# Altium schematic sheet УШЯИ.411522.033Э3_5.SchDoc
size 420 x 297 mm; SheetNumber: 5; SheetTotal: 5
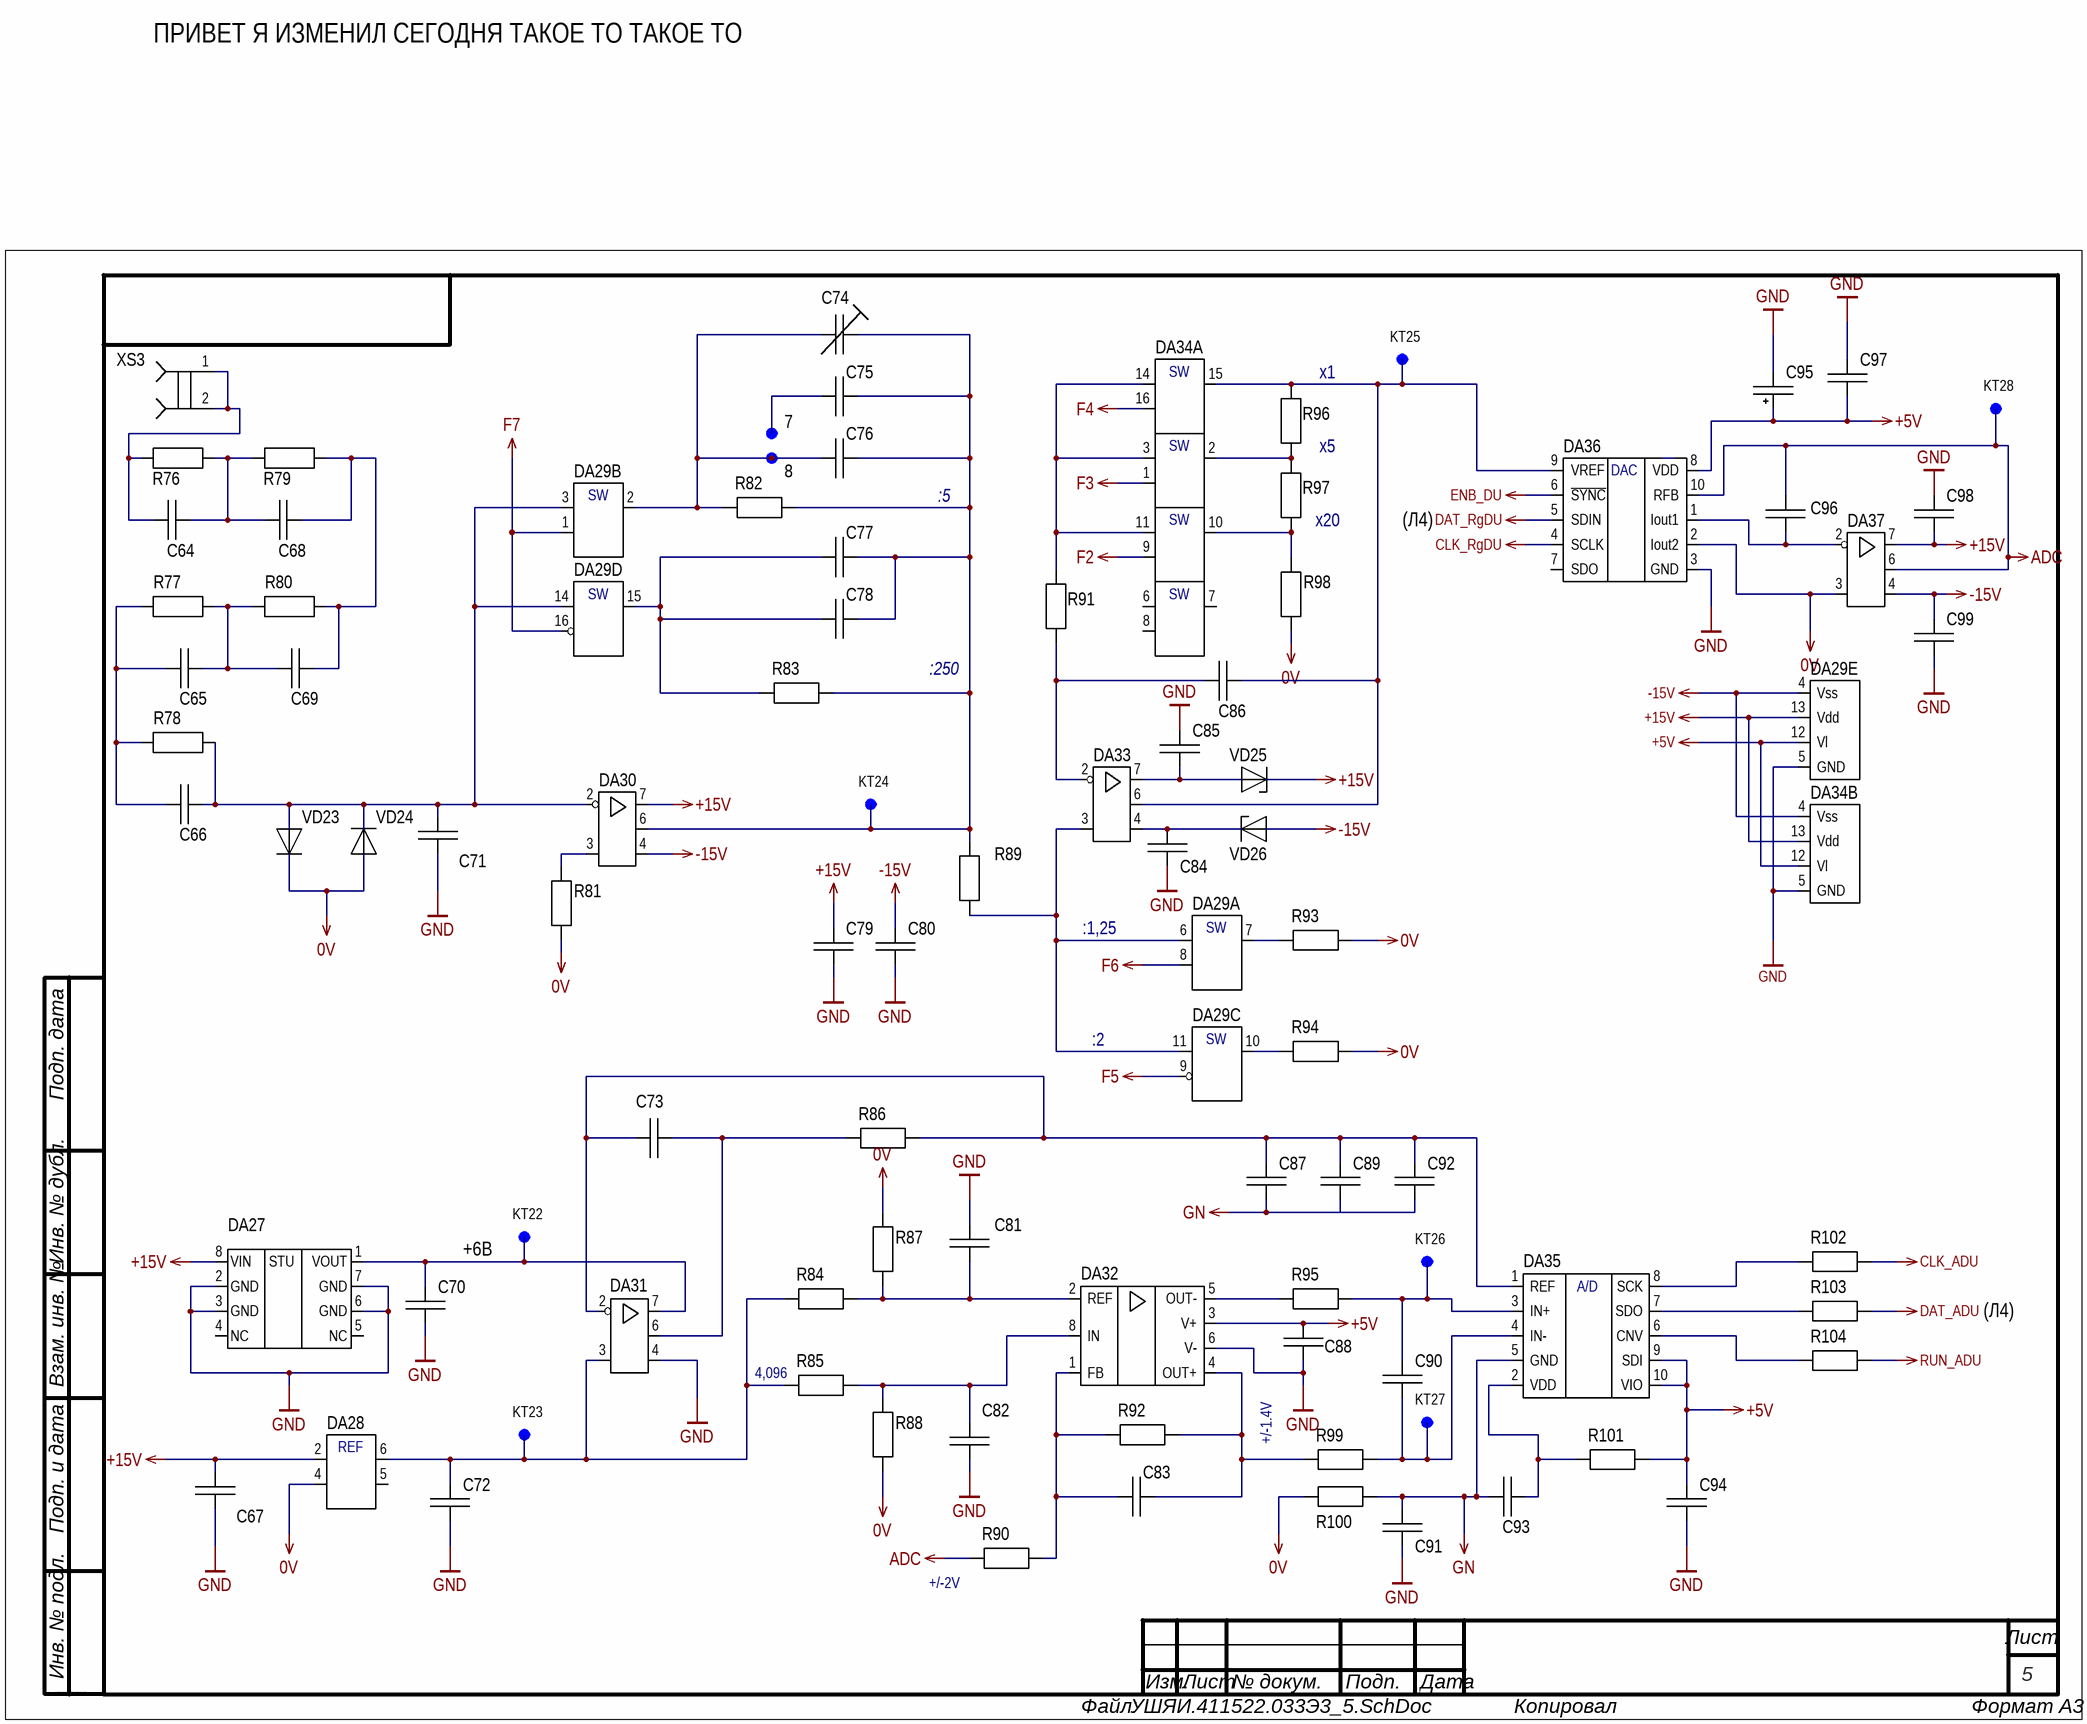
[diagram p0: УШЯИ.411522.033Э3_5.SchDoc]

## Parts
7  OTV10  [OTV10]  (value not drawn)  (no BOM)
8  OTV10  [OTV10]  (value not drawn)  (no BOM)
C64  CC45SL3JD470JYGNA  [CC45S]  (value not drawn)
C65  CC45SL3JD470JYGNA  [CC45S]  (value not drawn)
C66  CC45SL3JD470JYGNA  [CC45S]  (value not drawn)
C67  1206-X7R-50 B-0,33 мкФ+-10%  [CAP: 1206]  (value not drawn)
C68  CC45SL3JD470JYGNA  [CC45S]  (value not drawn)
C69  CC45SL3JD470JYGNA  [CC45S]  (value not drawn)
C70  1206-X7R-50 B-0,1 мкФ+-10%  [CAP: 1206]  (value not drawn)
C71  1206-X7R-50 B-120 пФ+-10%  [CAP: 1206]  (value not drawn)
C72  1206-X7R-50 B-0,1 мкФ+-10%  [CAP: 1206]  (value not drawn)
C73  1206-X7R-50 B-1 нФ+-10%  [CAP: 1206]  (value not drawn)
C74  TZC3P200A110  [TZC3]  (value not drawn)
C75  1206-NP0-50 B-10 пФ+-5%  [CAP: 1206]  (value not drawn)
C76  1206-X7R-50 B-22 пФ+-10%  [CAP: 1206]  (value not drawn)
C77  0805-NP0-50 В-2200 пФ +-1%  [CAP: 0805]  (value not drawn)
C78  0805-NP0-50 В-150 пФ +-1%  [CAP: 0805]  (value not drawn)
C79  1206-X7R-50 B-0,33 мкФ+-10%  [CAP: 1206]  (value not drawn)
C80  1206-X7R-50 B-0,33 мкФ+-10%  [CAP: 1206]  (value not drawn)
C81  1206-X7R-50 B-0,1 мкФ+-10%  [CAP: 1206]  (value not drawn)
C82  1206-X7R-50 B-0,1 мкФ+-10%  [CAP: 1206]  (value not drawn)
C83  0805-C0G-50 В-240 пФ +-5%  [CAP: 0805]  (value not drawn)
C84  1206-X7R-50 B-0,33 мкФ+-10%  [CAP: 1206]  (value not drawn)
C85  1206-X7R-50 B-0,33 мкФ+-10%  [CAP: 1206]  (value not drawn)
C86  1206-X7R-50 B-33 пФ+-10%  [CAP: 1206]  (value not drawn)
C87  0805-X5R-25 В-10 мкФ +-10%  [CAP: 0805]  (value not drawn)
C88  1206-X7R-50 B-0,1 мкФ+-10%  [CAP: 1206]  (value not drawn)
C89  1206-X7R-50 B-2,2 мкФ+-10%  [CAP: 1206]  (value not drawn)
C90  1206-X7R-50 B-0,01 мкФ+-10%  [CAP: 1206]  (value not drawn)
C91  1206-X7R-50 B-1 нФ+-10%  [CAP: 1206]  (value not drawn)
C92  1206-X7R-50 B-2,2 мкФ+-10%  [CAP: 1206]  (value not drawn)
C93  1206-X7R-50 B-2,2 мкФ+-10%  [CAP: 1206]  (value not drawn)
C94  1206-X7R-50 B-0,33 мкФ+-10%  [CAP: 1206]  (value not drawn)
C95  TAJA106K010RNJ  [Tantal A]  (value not drawn)
C96  1206-X7R-50 B-33 пФ+-10%  [CAP: 1206]  (value not drawn)
C97  1206-X7R-50 B-0,1 мкФ+-10%  [CAP: 1206]  (value not drawn)
C98  1206-X7R-50 B-0,33 мкФ+-10%  [CAP: 1206]  (value not drawn)
C99  1206-X7R-50 B-0,33 мкФ+-10%  [CAP: 1206]  (value not drawn)
DA27  L78L06ACD13TR  [8-SOIC]  (value not drawn)
DA28  ADR434BR  [8-SOIC]  (value not drawn)
DA29  ADG433BR  [16-SOIC]  (value not drawn)  (parts A,B,C,D,E of 5)
DA30  ADA4627-1ARZ  [8-SOIC]  (value not drawn)
DA31  AD8031ARZ  [8-SOIC]  (value not drawn)
DA32  ADA4941-1YRZ  [8-SOIC]  (value not drawn)
DA33  ADA4627-1ARZ  [8-SOIC]  (value not drawn)
DA34  ADG432BR  [16-SOIC]  (value not drawn)  (parts A,B of 2)
DA35  AD7691BRM  [10-MSOP]  (value not drawn)
DA36  AD5443YRM  [10-MSOP]  (value not drawn)
DA37  ADA4627-1ARZ  [8-SOIC]  (value not drawn)
KT22  OTV10  [OTV10]  (value not drawn)  (no BOM)
KT23  OTV10  [OTV10]  (value not drawn)  (no BOM)
KT24  OTV10  [OTV10]  (value not drawn)  (no BOM)
KT25  OTV10  [OTV10]  (value not drawn)  (no BOM)
KT26  OTV10  [OTV10]  (value not drawn)  (no BOM)
KT27  OTV10  [OTV10]  (value not drawn)  (no BOM)
KT28  OTV10  [OTV10]  (value not drawn)  (no BOM)
R76  С2-29В-2-2 МОм +-0.5%-1,0-А  [C2-29-2]  (value not drawn)
R77  С2-29В-2-2 МОм +-0.5%-1,0-А  [C2-29-2]  (value not drawn)
R78  С2-29В-2-2 МОм +-0.5%-1,0-А  [C2-29-2]  (value not drawn)
R79  С2-29В-2-2 МОм +-0.5%-1,0-А  [C2-29-2]  (value not drawn)
R80  С2-29В-2-2 МОм +-0.5%-1,0-А  [C2-29-2]  (value not drawn)
R81  1206-1 МОм+-5%  [1206]  (value not drawn)
R82  1206-2 МОм+-0,1%  [1206]  (value not drawn)
R83  1206-40,2 кОм+-0,1%  [1206]  (value not drawn)
R84  1206-24,9 кОм+-0,5%  [1206]  (value not drawn)
R85  1206-24,9 кОм+-0,5%  [1206]  (value not drawn)
R86  1206-2,2 Ом+-5%  [1206]  (value not drawn)
R87  1206-30 кОм+-0.1%  [1206]  (value not drawn)
R88  1206-11,8 кОм+-0,1%  [1206]  (value not drawn)
R89  1206-4,99 кОм+-0,1%  [1206]  (value not drawn)
R90  1206-20 кОм+-0,1%  [1206]  (value not drawn)
R91  1206-8,2 кОм+-5%  [1206]  (value not drawn)
R92  1206-14 кОм+-0,1%  [1206]  (value not drawn)
R93  1206-20 кОм+-0,1%  [1206]  (value not drawn)
R94  1206-4,99 кОм+-0,1%  [1206]  (value not drawn)
R95  1206-510 Ом+-5%  [1206]  (value not drawn)
R96  0805-32 кОм+-0,1%  [0805]  (value not drawn)
R97  0805-6,04 кОм+-0,1%  [0805]  (value not drawn)
R98  0805-2 кОм+-0,1%  [0805]  (value not drawn)
R99  1206-510 Ом+-5%  [1206]  (value not drawn)
R100  1206-22 Ом+-5%  [1206]  (value not drawn)
R101  1206-24 Ом+-5%  [1206]  (value not drawn)
R102  1206-33 Ом+-5%  [1206]  (value not drawn)
R103  1206-33 Ом+-5%  [1206]  (value not drawn)
R104  1206-33 Ом+-5%  [1206]  (value not drawn)
VD23  1N4148WS  [SOD-323F]  (value not drawn)
VD24  1N4148WS  [SOD-323F]  (value not drawn)
VD25  BZX55-C5V6  [DO-35]  (value not drawn)
VD26  BZX55-C5V6  [DO-35]  (value not drawn)
XS3  280358-0  (value not drawn)

## Nets
0V: DA28.4(GND) DA36.2(Iout2) DA37.3(+IN) R81.1 R87.2 R88.1 R93.2 R94.2 R98.1 R100.1 VD23.1 VD24.2
+5V: C88.1 C94.2 C95.1 C97.1 DA29.12(Vl) DA32.3(V+) DA34.12(Vl) DA35.9(SDI) DA35.10(VIO) DA36.8(VDD) R101.2
+15V: C67.2 C79.2 C98.1 DA27.8(VIN) DA28.2(+Vin) DA29.13(Vdd) DA30.7(Vs+) DA34.13(Vdd) DA37.7(Vs+) VD25.1
-15V: C80.2 C99.2 DA29.4(Vss) DA30.4(Vs-) DA34.4(Vss) DA37.4(Vs-) VD26.2
ADC: C96.2 DA36.10(RFB) DA37.6(OUT) KT28.1 R90.1
CLK_ADU: R102.2
CLK_RgDU: DA36.4(SCLK)
DAT_ADU: R103.2
DAT_RgDU: DA36.5(SDIN)
ENB_DU: DA36.6(~{SYNC})
F2: DA34.9(IN3)
F3: DA34.1(IN1)
F4: DA34.16(IN2)
F5: DA29.9(IN3)
F6: DA29.8(IN4)
F7: DA29.1(IN1) DA29.16(IN2)
GN: C87.1 C89.1 C91.2 C92.1 C93.2 DA35.5(GND) R100.2
GND: C67.1 C70.2 C71.1 C72.1 C79.1 C80.1 C81.2 C82.1 C84.1 C85.1 C88.2 C91.1 C94.1 C95.2 C97.2 C98.2 C99.1 DA27.2(GND) DA27.3(GND) DA27.6(GND) DA27.7(GND) DA29.5(GND) DA31.4(Vs-) DA32.6(V-) DA34.5(GND) DA36.3(GND)
RUN_ADU: R104.2
Net7_?1: 7.?1 C75.1
Net8_?1: 8.?1 C74.1 C76.1 DA29.2(D1) R82.1
NetC64_1: C64.1 R76.1 XS3.1 XS3.2
NetC64_2: C64.2 C68.1 R76.2 R79.1
NetC65_1: C65.1 C66.1 R77.1 R78.1
NetC65_2: C65.2 C69.1 R77.2 R80.1
NetC66_2: C66.2 C71.2 DA29.3(S1) DA29.14(S2) DA30.2(-IN) R78.2 VD23.2 VD24.1
NetC68_2: C68.2 C69.2 R79.2 R80.2
NetC70_1: C70.1 DA27.1(VOUT) DA31.7(Vs+) KT22.1
NetC72_2: C72.2 DA28.6(Vout) DA31.3(+IN) KT23.1 R84.1 R85.1
NetC73_1: C73.1 C87.2 C89.2 C92.2 DA31.2(-IN) DA35.1(REF) R86.2
NetC73_2: C73.2 DA31.6(OUT) R86.1
NetC74_2: C74.2 C75.2 C76.2 C77.2 C78.2 DA30.6(OUT) KT24.1 R82.2 R83.2 R89.1
NetC77_1: C77.1 C78.1 DA29.15(D2) R83.1
NetC81_1: C81.1 DA32.2(REF) R84.2 R87.1
NetC82_2: C82.2 DA32.8(IN) R85.2 R88.2
NetC83_1: C83.1 DA32.1(FB) R90.2 R92.1
NetC83_2: C83.2 DA32.4(OUT+) R92.2 R99.1
NetC84_2: C84.2 DA33.4(Vs-) VD26.1
NetC85_2: C85.2 DA33.7(Vs+) VD25.2
NetC86_1: C86.1 DA33.2(-IN) R91.1
NetC86_2: C86.2 DA33.6(OUT) DA34.15(D2) DA36.9(VREF) KT25.1 R96.2
NetC90_1: C90.1 DA35.4(IN-) KT27.1 R99.2
NetC90_2: C90.2 DA35.3(IN+) KT26.1 R95.2
NetC93_1: C93.1 DA35.2(VDD) R101.1
NetC96_1: C96.1 DA36.1(Iout1) DA37.2(-IN)
NetDA29_6: DA29.6(S4) DA29.11(S3) DA33.3(+IN) R89.2
NetDA29_7: DA29.7(D4) R93.1
NetDA29_10: DA29.10(D3) R94.1
NetDA30_3: DA30.3(+IN) R81.2
NetDA32_5: DA32.5(OUT-) R95.1
NetDA34_2: DA34.2(D1) R96.1 R97.2
NetDA34_3: DA34.3(S1) DA34.11(S3) DA34.14(S2) R91.2
NetDA34_10: DA34.10(D3) R97.1 R98.2
NetDA35_6: DA35.6(CNV) R104.1
NetDA35_7: DA35.7(SDO) R103.1
NetDA35_8: DA35.8(SCK) R102.1

Not connected (* = marked no-connect by the designer): DA27 4(NC) 5(NC); DA28 5(TRIM); DA34 6(S4) 7(D4) 8(IN4); DA36 7(SDO)

## Notes on the sheet
- ПРИВЕТ Я ИЗМЕНИЛ СЕГОДНЯ ТАКОЕ ТО ТАКОЕ ТО
- (near R96) x1
- x5
- :5
- (near R97) x20
- (Л4)
- :250
- :1,25
- :2
- (near KT22) +6В
- (near R85) 4,096
- +/-1.4V
- (near R90) +/-2V
- Подп. дата
- Инв. № дубл.
- Взам. инв. №
- Подп. и дата
- Инв. № подл.
- Изм.
- Лист
- № докум.
- Подп.
- Дата
- ALTIUM GOSTBOM2.0 KEV
- Файл:
- Копировал
- Формат А3
- (in symbol AD5443YRM) DAC
- (in symbol AD7691BRM) A/D
- (in symbol ADG432BR, part A) SW
- (in symbol ADG433BR, part A) SW
- (in symbol ADG433BR, part B) SW
- (in symbol ADG433BR, part C) SW
- (in symbol ADG433BR, part D) SW
- (in symbol ADR434BR) REF
- (in symbol L78L06ACD13TR) STU

## Library data of the parts
C64-C66 C68 C69 = CC45SL3JD470JYGNA: CC45 series; Value: 47pF
C70 C72 C81 C82 C88 C97 = 1206-X7R-50 B-0,1 мкФ+-10%: Value: 0,1 мкФ
C71 = 1206-X7R-50 B-120 пФ+-10%: Value: 120 пФ
C73 C91 = 1206-X7R-50 B-1 нФ+-10%: Value: 1 нФ
C74 = TZC3P200A110: Подстроечный конденсатор  5-20пФ, 100В
C75 = 1206-NP0-50 B-10 пФ+-5%: Value: 10 пФ
C76 = 1206-X7R-50 B-22 пФ+-10%: Value: 22 пФ
C77 = 0805-NP0-50 В-2200 пФ +-1%: Value: 2200 пФ
C78 = 0805-NP0-50 В-150 пФ +-1%: Value: 150 пФ
C83 = 0805-C0G-50 В-240 пФ +-5%: Value: 10 пФ
C86 C96 = 1206-X7R-50 B-33 пФ+-10%: Value: 33 пФ
C87 = 0805-X5R-25 В-10 мкФ +-10%: Value: 10 мкФ
C89 C92 C93 = 1206-X7R-50 B-2,2 мкФ+-10%: Value: 2,2 мкФ
C95 = TAJA106K010RNJ: Cap Tant Solid 10uF 10V A CASE 10%; Tolerance: 20%; Voltage: 16V; Value: 10 мкФ
DA29 = ADG433BR: LC2MOS Precision Quad SPST Switches; Value: *
DA30 DA33 DA37 = ADA4627-1ARZ: 30 V, High Speed, Low Noise, Low Bias / Current, JFET Operational Amplifier
DA31 = AD8031ARZ: Rail-to-Rail I/O Amplifiers 2.7 V, 800 μA, 80 MHz
DA32 = ADA4941-1YRZ: Single-Supply, Differential, 18-Bit ADC Driver
DA34 = ADG432BR: LC2MOS Precision Quad SPST Switches; Value: *
DA36 = AD5443YRM: 12-Bit High Bandwidth / Multiplying DACs with Serial Interface / 10-MSOP
R76-R80 = С2-29В-2-2 МОм +-0.5%-1,0-А: Резисторы постоянные непроволочные прецизионные С2-29В, производитель "АО"НПО"ЭРКОН""АО"НПО"ЭРКОН"; Номинальная мощность рассеяния: 1 Вт; Диапазон значений номинальных сопротивлений: от 1 Ом до 8,56 МОм; Ряд сопротивлений: Е192; Категории качества: ВП; ТУ: ОЖО.467.099 ТУ
R81 = 1206-1 МОм+-5%: Value: 1 МОм; ModelPrint: 1206
R82 = 1206-2 МОм+-0,1%: Value: 2 МОм; ModelPrint: 1206
R86 = 1206-2,2 Ом+-5%: Value: 2,2 кОм; ModelPrint: 1206
R87 = 1206-30 кОм+-0.1%: Value: 30 кОм; ModelPrint: 1206
R90 R93 = 1206-20 кОм+-0,1%: Value: 20 кОм; ModelPrint: 1206
R91 = 1206-8,2 кОм+-5%: Value: 8,2 кОм; ModelPrint: 1206
R92 = 1206-14 кОм+-0,1%: Value: 14 кОм; ModelPrint: 1206
R95 R99 = 1206-510 Ом+-5%: Value: 510 Ом; ModelPrint: 1206
R97 = 0805-6,04 кОм+-0,1%: Value: 6,04 кОм; ModelPrint: 0805
R98 = 0805-2 кОм+-0,1%: Value: 2 кОм; ModelPrint: 0805
R100 = 1206-22 Ом+-5%: Value: 22 Ом; ModelPrint: 1206
R101 = 1206-24 Ом+-5%: Value: 24 Ом; ModelPrint: 1206
R102-R104 = 1206-33 Ом+-5%: Value: 33 Ом; ModelPrint: 1206
VD23 VD24 = 1N4148WS: Small Signal Fast Switching Diod; Value: *
VD25 VD26 = BZX55-C5V6: Стабилитрон BZX55-C5V6; Value: *
XS3 = 280358-0: TE Connectivity 2,54mm / for wire
C67 C79 C80 C84 C85 C94 C98 C99 = 1206-X7R-50 B-0,33 мкФ+-10%: Value: 0,33 мкФ
C90 = 1206-X7R-50 B-0,01 мкФ+-10%: Value: 0,01 мкФ
R83 = 1206-40,2 кОм+-0,1%: ModelPrint: 1206; Value: 40,2 кОм
R84 R85 = 1206-24,9 кОм+-0,5%: ModelPrint: 1206; Value: 24,9 кОм
R88 = 1206-11,8 кОм+-0,1%: ModelPrint: 1206; Value: 11,8 кОм
R89 R94 = 1206-4,99 кОм+-0,1%: ModelPrint: 1206; Value: 4,99 кОм